# Altium schematic sheet 3_peripherals.SchDoc
size A4; SheetNumber: 3; SheetTotal: 3
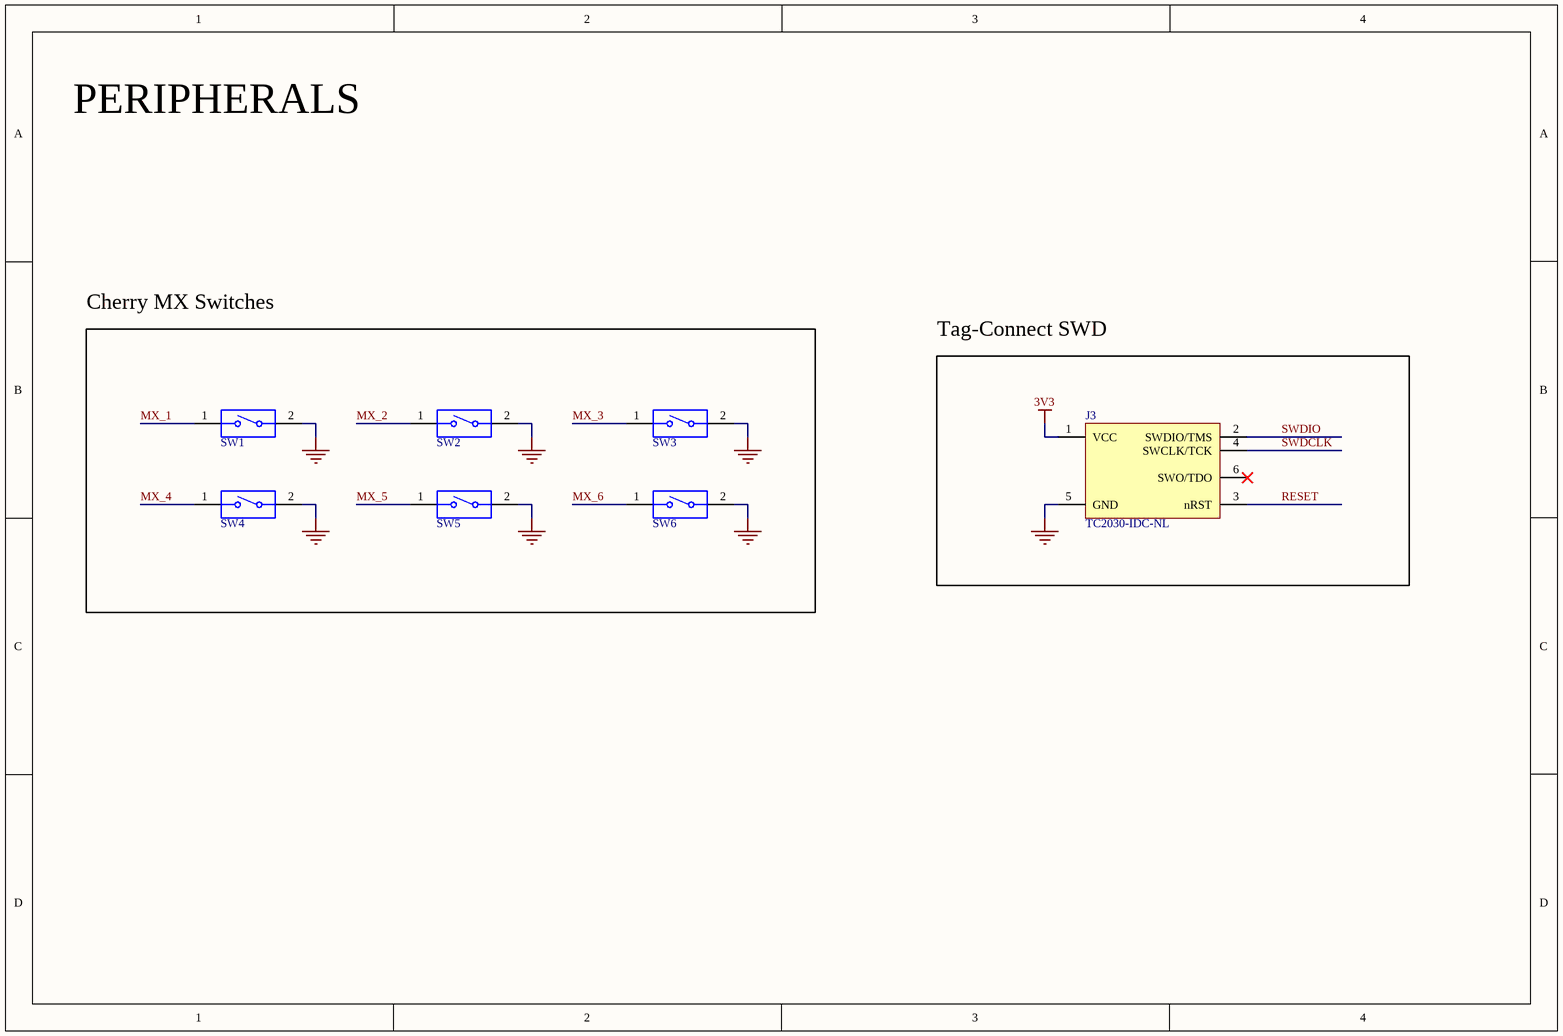
[diagram p0: 3_peripherals.SchDoc]

## Parts
J3  TC2030-IDC-NL  [TAG_TC2030-IDC-NL]
SW1  MX1A-11NW  [CHRY-MX1A-11NW_V]  (value not drawn)
SW2  MX1A-11NW  [CHRY-MX1A-11NW_V]  (value not drawn)
SW3  MX1A-11NW  [CHRY-MX1A-11NW_V]  (value not drawn)
SW4  MX1A-11NW  [CHRY-MX1A-11NW_V]  (value not drawn)
SW5  MX1A-11NW  [CHRY-MX1A-11NW_V]  (value not drawn)
SW6  MX1A-11NW  [CHRY-MX1A-11NW_V]  (value not drawn)

## Blocks framed on the sheet
Cherry MX Switches: SW1-SW6
Tag-Connect SWD: J3

## Nets
3V3: J3.1(VCC)
GND: J3.5(GND) SW1.2 SW2.2 SW3.2 SW4.2 SW5.2 SW6.2
MX_1: SW1.1
MX_2: SW2.1
MX_3: SW3.1
MX_4: SW4.1
MX_5: SW5.1
MX_6: SW6.1
RESET: J3.3(nRST)
SWDCLK: J3.4(SWCLK/TCK)
SWDIO: J3.2(SWDIO/TMS)

Not connected (* = marked no-connect by the designer): J3 6(SWO/TDO)*

## Notes on the sheet
- PERIPHERALS

## Library data of the parts
J3 = CMP-031-000000-3: CABLE ADAPTER 6 POS; Package: None; Value: *; Availability: https://www.tag-connect.com/product/tc2030-idc-nl; Pin Count: 6; Price: None; Component Type: Standard; Source: TC2030-IDC-NL.SchLib; Design Item ID: TC2030-IDC-NL; MP: TC2030-IDC-NL
SW1-SW6 = CMP-011-00018-1: Keypad Switch, 1 Switches, SPST, Momentary, 0.01A, 12VDC, 0.78N, Solder Terminal, Through Hole-straight; Manufacturer Series: MX; Contact Voltage(DC)-Max: 12V; Body Breadth: 15.6inch; Electrical Life: 50000000Cycles; Body Length or Diameter: 15.6mm; Contact Bounce Time-Max: 5ms; Circuit Configuration: 1X1; Body Height: 11.6mm; Contact DC Max Rating R Load: .01A@12VDC; Contact Current(DC)-Max: 10mA; Number of Switches: 1; Min Operating Temperature: -10°C; RoHS Compliant: Yes; Termination: Solder; Switch Action: MOMENTARY; Switch Type: Keypad; Operating Force-Max: 0.78N; Max Operating Temperature: 70°C; Switch Function: SPST; Mounting Technology: Through Hole; Reach SVHC Compliant: Yes